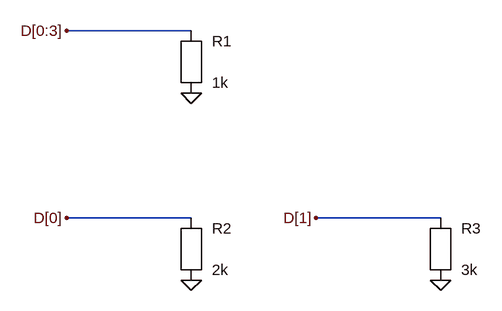
[diagram p0: schematic bus_label.asc]
bus_label.asc, the LTspice schematic file:
Version 4
SHEET 1 880 680
WIRE 96 96 288 96
WIRE 96 384 288 384
WIRE 480 384 672 384
FLAG 96 96 D[0:3]
FLAG 96 384 D[0]
FLAG 480 384 D[1]
FLAG 288 192 0
FLAG 288 480 0
FLAG 672 480 0
SYMBOL res 288 144 R0
SYMATTR InstName R1
SYMATTR Value 1k
SYMBOL res 288 432 R0
SYMATTR InstName R2
SYMATTR Value 2k
SYMBOL res 672 432 R0
SYMATTR InstName R3
SYMATTR Value 3k

The netlist it stands for:
* bus_label.asc
R1 D[0:3] 0 1k
R2 D[0] 0 2k
R3 D[1] 0 3k
.backanno
.end